# EAGLE design MC-10 Mod A_V (EAGLE 7.2.0)
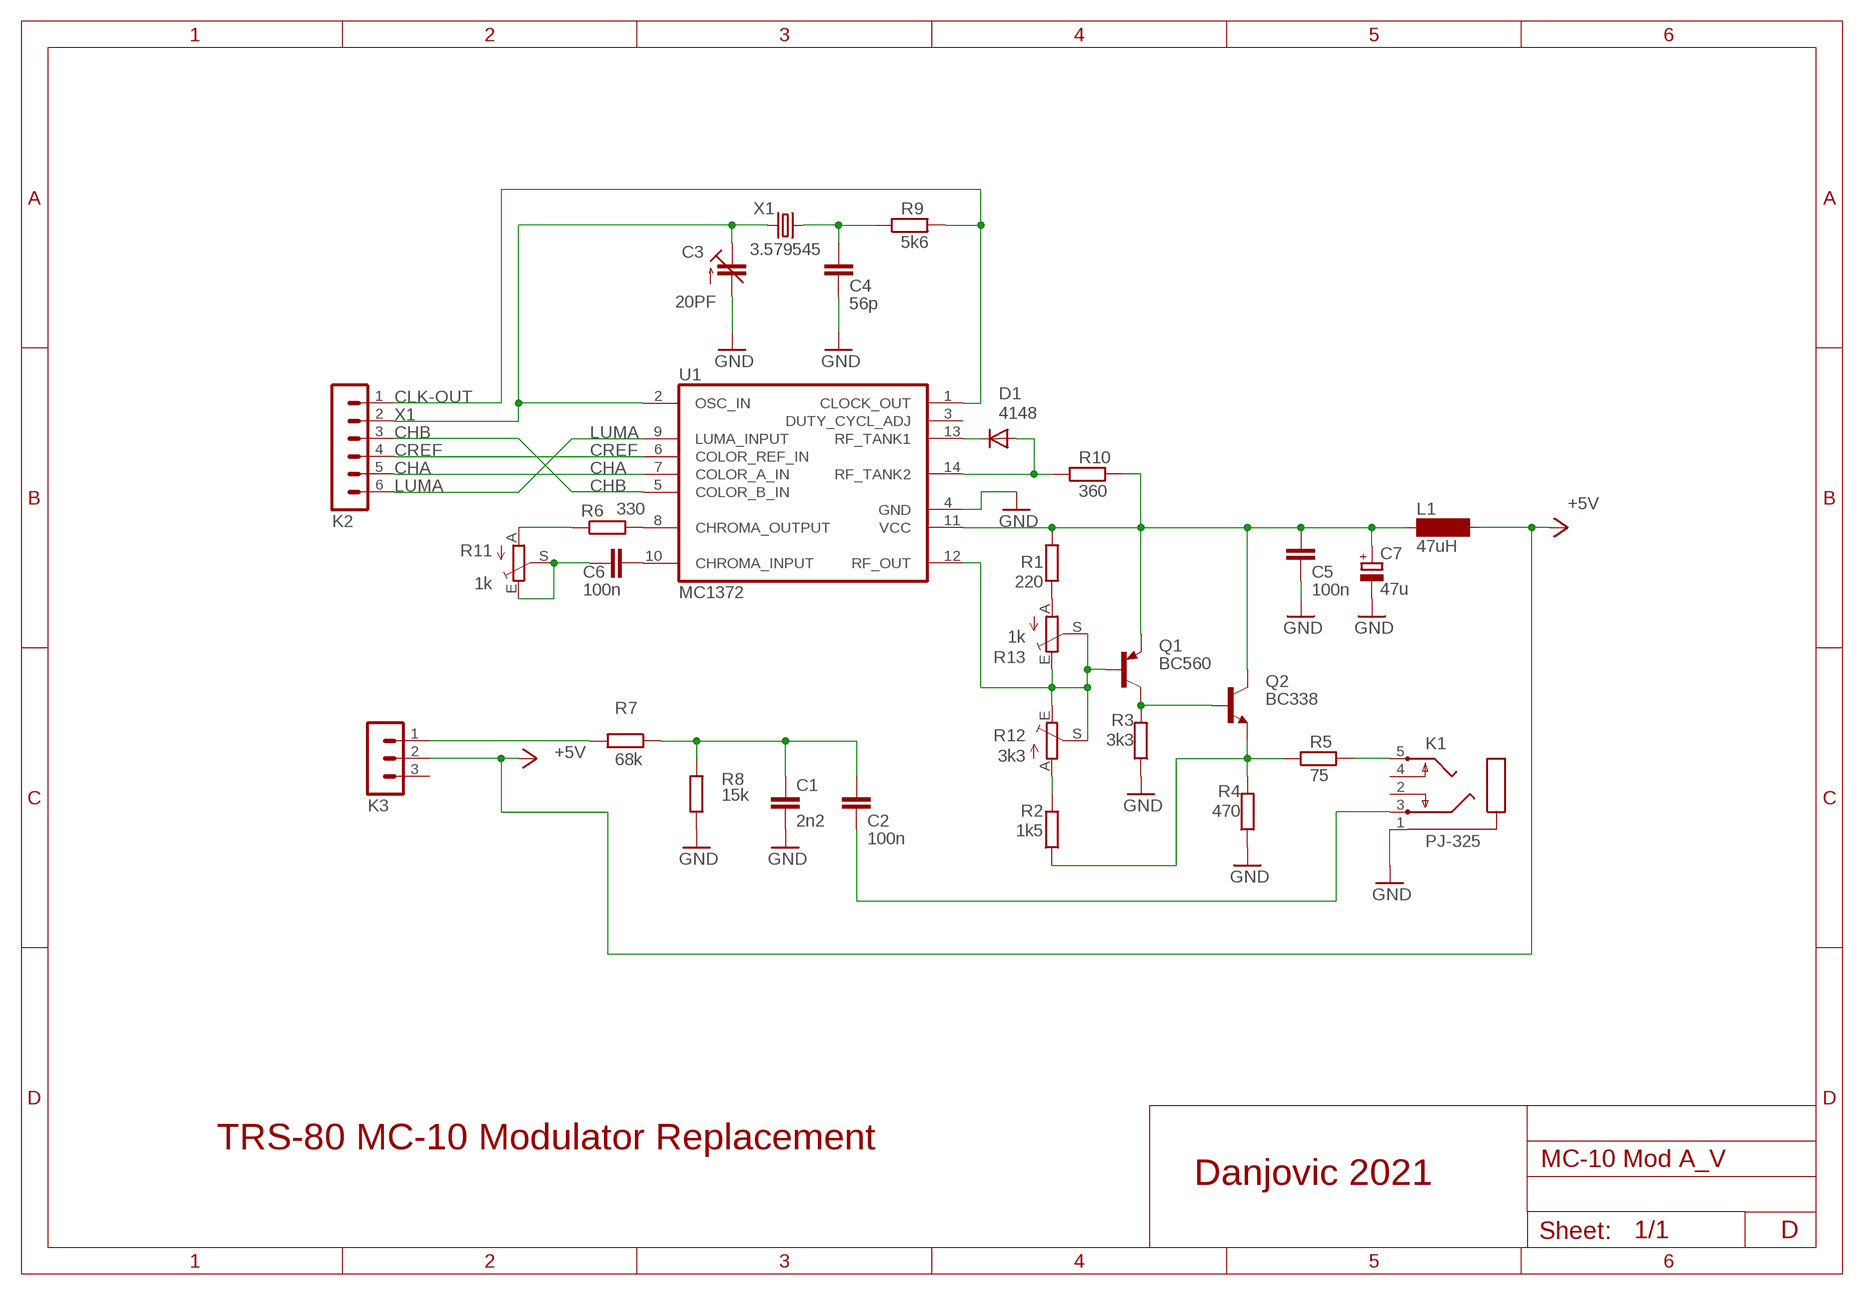
[diagram p0: schematic, sheet 1]

## Parts
C1  2n2  C-EU050-024X044  [C050-024X044]
C2  100n  C-EU050-024X044  [C050-024X044]
C3  20PF  C-TRIMM3050.504  [CTRIM3050.504]
C4  56p  C-EU025-024X044  [C025-024X044]
C5  100n  C-EU050-024X044  [C050-024X044]
C6  100n  C-EU050-024X044  [C050-024X044]
C7  47u  CPOL-EUE2.5-5  [E2,5-5]
D1  4148  DIODE-D-5  [D-5]
K1  PJ-325  [PJ325]
K2  MA06-1  [MA06-1]
K3  MA03-1  [MA03-1]
L1  47uH  BS75  [BS75]
Q1  BC560  BC327  [TO92-EBC]
Q2  BC338  [TO92-EBC]
R1  220  R-EU_0204/7  [0204/7]
R2  1k5  R-EU_0204/7  [0204/7]
R3  3k3  R-EU_0204/7  [0204/7]
R4  470  R-EU_0204/7  [0204/7]
R5  75  R-EU_0204/7  [0204/7]
R6  330  R-EU_0204/7  [0204/7]
R7  68k  R-EU_0204/7  [0204/7]
R8  15k  R-EU_0204/7  [0204/7]
R9  5k6  R-EU_0204/7  [0204/7]
R10  360  R-EU_0204/7  [0204/7]
R11  1k  TRIM_EU-RS3  [RS3]
R12  3k3  TRIM_EU-RS3  [RS3]
R13  1k  TRIM_EU-RS3  [RS3]
U1  MC1372  [DIL14]
X1  3.579545  CRYSTALHC49U70  [HC49U70]

## Nets
+5V: K3.2 L1.2
AUD-OUT: C2.2 K1.3
CHA: K2.5 U1.7(COLOR_A_IN)
CHB: K2.3 U1.5(COLOR_B_IN)
CLK-OUT: K2.1 R9.2 U1.1(CLOCK_OUT)
CREF: K2.4 U1.6(COLOR_REF_IN)
GND: C1.2 C3.2(A) C4.2 C5.2 C7.- K1.1 R3.1 R4.1 R8.1 U1.4(GND)
LUMA: K2.6 U1.9(LUMA_INPUT)
N$1: R6.2 U1.8(CHROMA_OUTPUT)
N$3: C1.1 C2.1 R7.1 R8.2
N$4: D1.C U1.13(RF_TANK1)
N$6: R6.1 R11.A
N$7: Q1.B R12.E R12.S R13.E R13.S U1.12(RF_OUT)
N$8: C6.2 U1.10(CHROMA_INPUT)
N$9: C4.1 R9.1 X1.2
N$10: R1.1 R13.A
N$11: C6.1 R11.E R11.S
N$12: Q1.C Q2.B R3.2
N$13: Q2.E R2.1 R4.2 R5.1
N$14: R2.2 R12.A
N$19: D1.A R10.1 U1.14(RF_TANK2)
SOUND: K3.1 R7.2
VCC: C5.1 C7.+ L1.1 Q1.E Q2.C R1.2 R10.2 U1.11(VCC)
VID-OUT: K1.5 R5.2
X1: C3.1(E) K2.2 U1.2(OSC_IN) X1.1
Unconnected: K1.2 K1.4 K3.3 U1.3(DUTY_CYCL_ADJ)

## Notes on the sheet
- TRS-80 MC-10 Modulator Replacement
- Danjovic 2021
- D

## Library data of the parts
C1 C2 C4-C6 = rcl:C-EU: CAPACITOR, European symbol
C3 = rcl:C-TRIMM: Trimm capacitor
C7 = rcl:CPOL-EU: POLARIZED CAPACITOR, European symbol
D1 = diode:DIODE-: DIODE
K1 = AudioJack:PJ-325: Stereo Jack With Switches
K2 = con-lstb:MA06-1: PIN HEADER; OC_FARNELL: unknown; OC_NEWARK: unknown
K3 = con-lstb:MA03-1: PIN HEADER; OC_FARNELL: unknown; OC_NEWARK: unknown
L1 = inductor-neosid:BS: INDUCTOR nominal inductance, magnetically screened; OC_FARNELL: unknown; OC_NEWARK: unknown
Q1 = transistor-pnp:BC327*: PNP Transistror
Q2 = transistor-npn:BC338*: NPN Transistor
R1-R10 = rcl:R-EU_: RESISTOR, European symbol
R11-R13 = pot:TRIM_EU-: POTENTIOMETER
U1 = MC-10:MC1372: Color TV Video Modulator
X1 = crystal:CRYSTAL: CRYSTAL; OC_FARNELL: unknown; OC_NEWARK: unknown

## Board
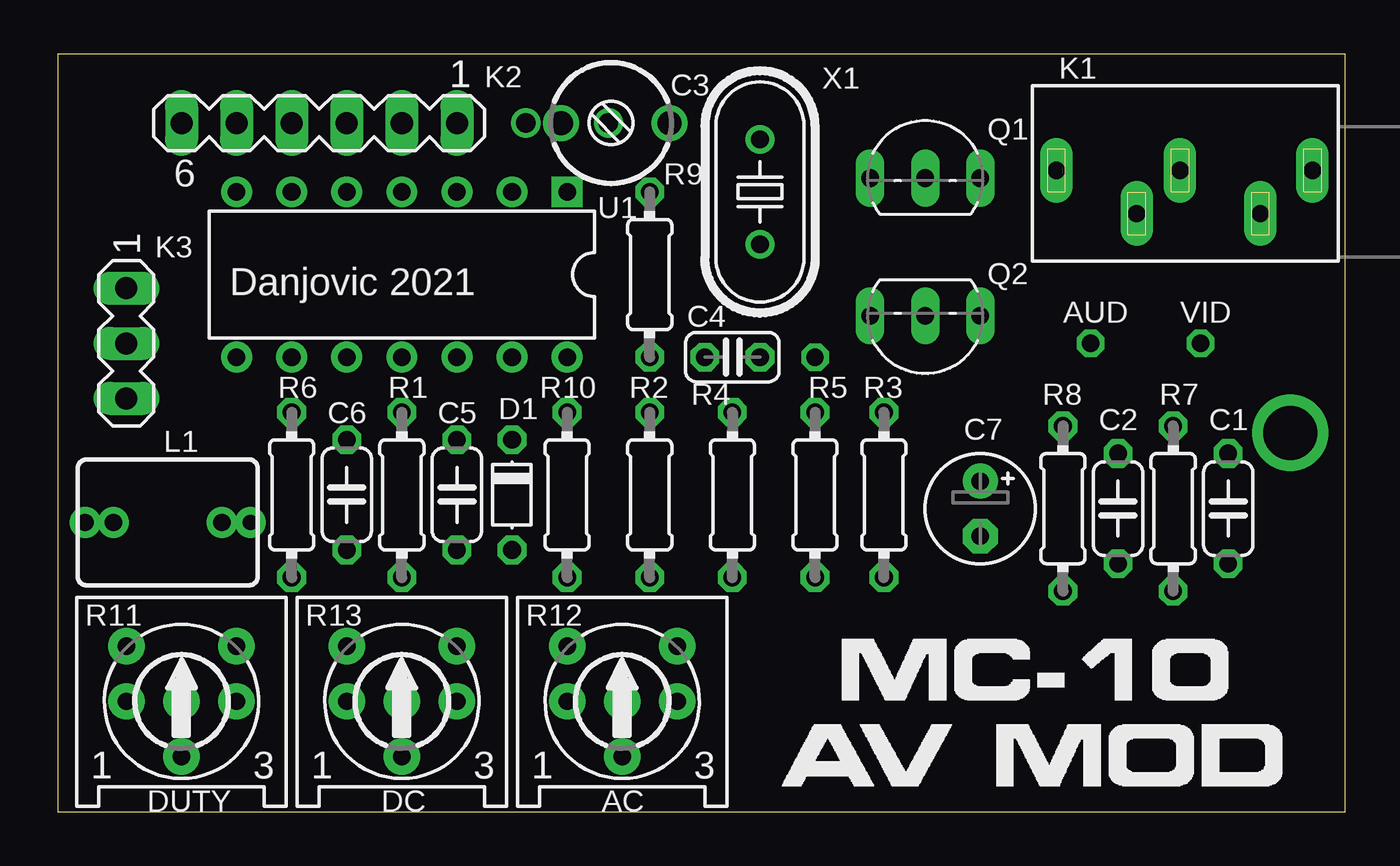
[diagram p1: board, top side]
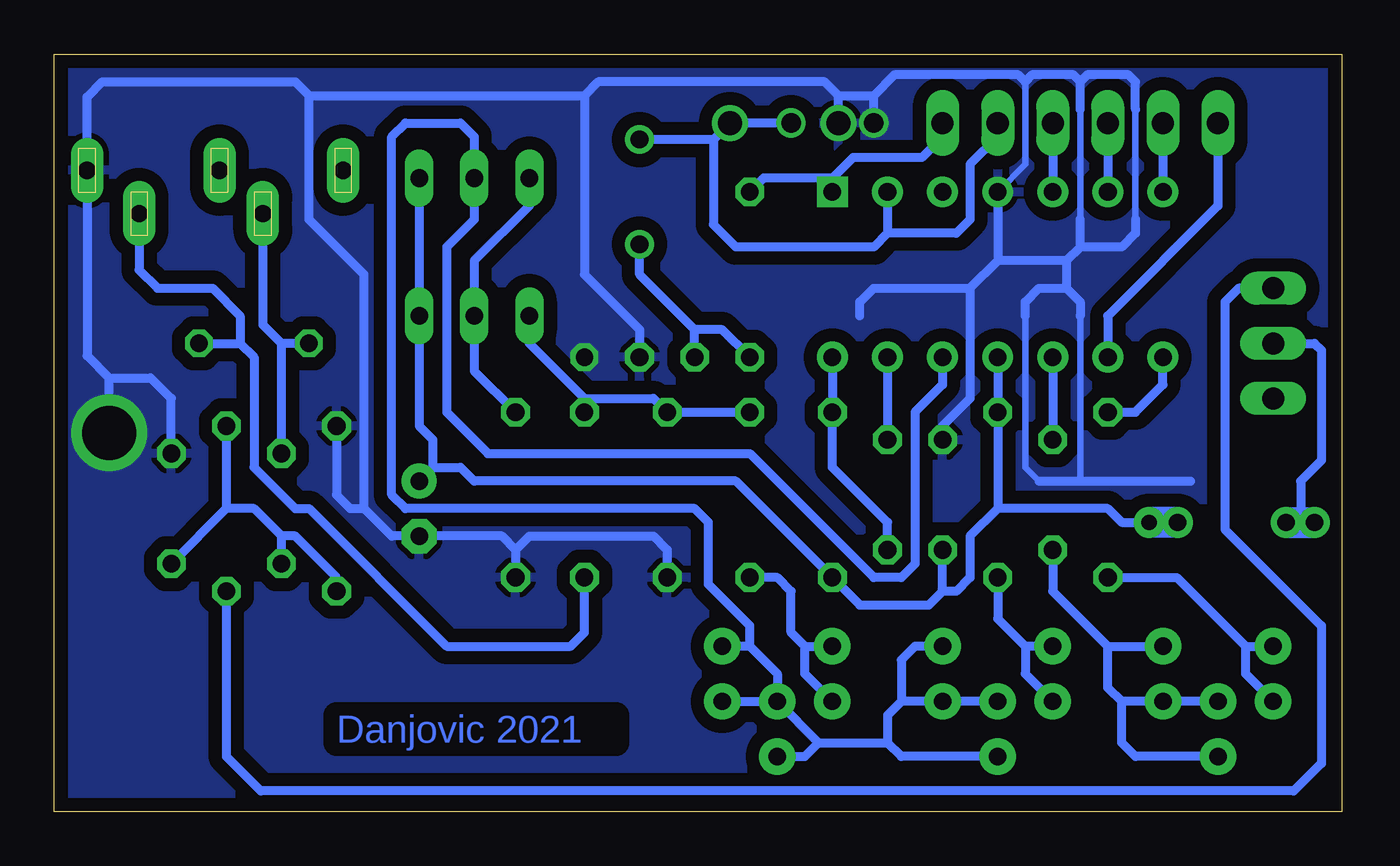
[diagram p2: board, bottom side, seen from below]

Size 59.37 x 34.92 mm. Coordinates in mm from the lower left corner, seen from the top.
Outline: 0,34.92 0,0 59.37,0 59.37,34.92 0,34.92
Copper layers (1*16): Top 0.035mm / dielectric 1.5mm / Bottom 0.035mm
Design rules "default *": minimum track width 10mil, minimum drill 24mil, track to track 8mil, track to pad 8mil, pad to pad 8mil, via to via 8mil, smd to smd 8mil, copper to edge 25mil, drill to drill 8mil, minimum pad ring 10mil, minimum via ring 8mil, stop-mask expansion 4mil, vias tented up to drill 0mil, thermal gap 10mil

### Footprints (pad centres in the part's own frame; a part is rotated, then mirrored left to right if it is on the bottom)
C050-024X044 = drill 0.813 octagon: 1 -2.54,0; 2 2.54,0
CTRIM3050.504 = drill 1.1: 1 -2.5,0; 2 2.5,0
C025-024X044 = drill 0.813 octagon: 1 -1.27,0; 2 1.27,0
E2,5-5 = drill 0.813 pad 1.6: + -1.27,0 | drill 0.813 pad 1.6 octagon: - 1.27,0
D-5 = drill 0.813 octagon: A 2.54,0; C -2.54,0
PJ325 = drill 0.8 pad 1.5 long: 1 1.2,-1; 2 7.3,-1; 3 9.3,1; 4 13,-1; 5 3.6,1
MA06-1 = drill 1.016 long: 1 -6.35,0; 2 -3.81,0; 3 -1.27,0; 4 1.27,0; 5 3.81,0; 6 6.35,0
MA03-1 = drill 1.016 long: 1 -2.54,0; 2 0,0; 3 2.54,0
BS75 = drill 0.8 pad 1.422: 1 -2.5,0; 2 2.5,0
TO92-EBC = drill 0.813 long: B 0,-1.27; C -2.54,-1.27; E 2.54,-1.27
0204/7 = drill 0.813 octagon: 1 -3.81,0; 2 3.81,0
RS3 = drill 0.813 pad 1.676: A -2.54,2.54; E 2.54,2.54; S 0,-2.54
DIL14 = drill 0.813 pad 1.422 square: 1 -7.62,-3.81 | drill 0.813 pad 1.422: 2 -5.08,-3.81; 3 -2.54,-3.81; 4 0,-3.81; 5 2.54,-3.81; 6 5.08,-3.81; 7 7.62,-3.81; 8 7.62,3.81; 9 5.08,3.81; 10 2.54,3.81; 11 0,3.81; 12 -2.54,3.81; 13 -5.08,3.81; 14 -7.62,3.81
HC49U70 = drill 0.813: 1 -2.413,0; 2 2.413,0

### Placement (x,y rotation side)
C1  53.98,13.97 90 top
C2  48.9,13.97 90 top
C3  25.72,31.75 180 top
C4  31.11,20.95 0 top
C5  18.41,14.61 90 top
C6  13.34,14.61 90 top
C7  42.55,13.97 270 top
D1  20.95,14.61 270 top
K1  59.05,28.57 180 top
K2  12.06,31.75 180 top
K3  3.17,21.59 270 top
L1  5.08,13.34 180 top
Q1  40.01,30.48 0 top
Q2  40.01,21.59 180 top
R1  15.88,14.61 90 top
R2  27.3,14.61 270 top
R3  38.1,14.61 90 top
R4  31.11,14.61 90 top
R5  34.93,14.61 270 top
R6  10.79,14.61 90 top
R7  51.44,13.97 270 top
R8  46.36,13.97 270 top
R9  27.3,24.77 90 top
R10  23.49,14.61 270 top
R11  5.71,5.08 0 top
R12  26.04,5.08 0 top
R13  15.88,5.08 0 top
U1  15.88,24.77 180 top
X1  32.39,28.57 270 top

### Tracks (layer width: path | path; a pad name or v marks a point on that pad's centre or on a via)
+5V  (via drill 0.8 pad 1.42)
  Bottom 0.406: K3.2 1.27,21.59 0.95,21.27 0.95,16.19 1.91,15.24 1.91,13.34 | 0.95,13.65 v1.27,13.34
  Bottom 1.422: L1.2 1.91,13.34 v1.27,13.34
AUD-OUT  (via drill 0.8 pad 1.27)
  Bottom 0.406: C2.2 48.9,21.59 | 48.9,21.59 49.76,22.45 K1.3 | v47.62,21.59 48.9,21.59
CHA
  Bottom 0.406: K2.5 U1.7
CHB
  Bottom 0.406: K2.3 U1.5
CLK-OUT
  Bottom 0.406: K2.1 18.41,31.11 19.37,30.16 22.54,30.16 23.49,29.21 | 23.49,29.21 26.67,29.21 R9.2 | U1.1 23.49,29.21
CREF
  Bottom 0.406: K2.4 U1.6
GND  (via drill 0.8 pad 1.27, 0.9, 2.5)
  Bottom 0.305: 14.61,33.66 14.61,29.84 U1.4 | 14.61,22.86 14.61,15.88 13.97,15.24 | 12.06,22.86 12.06,15.24 | 12.06,32.38 12.06,27.3 | 9.53,32.38 9.53,27.3
  Bottom 0.406: U1.4 15.88,25.4 | 15.88,25.4 17.14,24.13 | 17.14,24.13 17.14,19.05 18.41,17.78 C5.2 | 12.06,33.66 11.75,33.97 9.84,33.97 9.53,33.66 9.53,32.38 | 12.06,32.38 12.06,33.66 | 12.06,33.66 12.38,33.97 14.29,33.97 14.61,33.66 14.92,33.97 20.64,33.97 21.59,33.02 | 34.93,33.02 34.29,33.66 23.85,33.66 23.22,33.02 | 34.93,33.02 34.93,24.77 32.39,22.23 C4.2 | 47.62,33.02 48.26,33.66 57.15,33.66 57.86,32.95 K1.1 57.86,21.02 56.83,20 | 47.62,33.02 34.93,33.02 | R4.1 31.11,12.06 31.75,12.7 37.47,12.7 38.1,12.06 | 45.09,13.97 45.09,24.77 47.62,27.3 47.62,33.02 | 9.53,27.3 9.53,26.67 10.16,26.04 12.06,26.04 | 12.06,26.04 12.06,27.3 | 12.06,26.04 12.7,25.4 | 12.7,25.4 12.7,24.13 | 12.7,24.13 12.06,23.5 12.06,22.86 | 12.7,25.4 15.88,25.4 | 14.61,22.86 14.61,23.5 13.97,24.13 12.7,24.13 | 22.22,22.86 22.22,23.5 21.59,24.13 17.14,24.13 | 13.97,15.24 12.06,15.24 6.99,15.24 | 38.1,12.06 R3.1 | 38.1,12.06 38.73,12.7 43.82,12.7 45.09,13.97 | R8.1 46.36,14.61 45.72,13.97 45.09,13.97 | v56.83,17.46 56.83,20 | C1.2 53.98,19.05 54.93,20 56.83,20 | v21.59,31.75 21.59,33.02 | C3.2 23.22,33.02 | 23.22,33.02 21.59,33.02
  other vias: 34.93,20.95
  pour Bottom (isolate 0.61): -0.64,34.92 -0.64,0 59.37,0 59.37,34.92
LUMA
  Bottom 0.406: K2.6 5.71,27.94 10.79,22.86 U1.9
N$1
  Bottom 0.406: R6.2 9.53,18.41 8.26,19.68 U1.8
N$3
  Bottom 0.406: R8.2 46.36,10.79 48.26,12.7 48.9,12.7 | 48.9,12.7 50.16,13.97 51.44,13.97 | 51.44,13.97 C1.1 | R7.1 51.44,13.97 | C2.1 48.9,12.7
N$4
  Bottom 0.406: U1.13 D1.C
N$6  (via drill 0.8 pad 1.68)
  Bottom 0.406: R6.1 7.62,10.79 4.45,7.62 | v3.17,5.08 4.45,6.35 4.45,7.62 | 4.45,7.62 R11.A
N$7  (via drill 0.8 pad 1.68)
  Bottom 0.406: U1.12 18.41,19.68 19.68,18.41 19.68,11.43 20.32,10.79 21.59,10.79 27.3,16.51 39.37,16.51 41.27,18.41 41.27,26.04 40.01,27.3 Q1.B 40.01,31.11 40.64,31.75 43.18,31.75 43.82,31.11 43.82,14.61 43.18,13.97 29.84,13.97 29.21,13.34 29.21,10.48 27.3,8.57 27.3,7.62 | 27.3,7.62 R12.E | 24.13,3.17 20.95,3.17 | 20.95,3.17 20.32,2.54 R13.S | 20.32,5.08 v18.41,5.08 v15.88,5.08 | 20.32,5.08 20.95,4.45 20.95,3.17 | R13.E 19.68,7.62 20.32,6.99 20.32,5.08 | v28.57,5.08 v26.04,5.08 | 27.3,7.62 26.04,6.35 v26.04,5.08 | v26.04,5.08 24.13,3.17 | R12.S 24.76,2.54 24.13,3.17
N$8
  Bottom 0.406: U1.10 C6.2
N$9
  Bottom 0.406: R9.1 28.57,22.23 29.84,22.23 | 29.84,22.23 32.39,24.77 X1.2 | C4.1 29.84,22.23
N$10  (via drill 0.8 pad 1.68)
  Bottom 0.406: R1.1 15.88,8.89 14.61,7.62 | 14.61,7.62 14.61,6.35 v13.34,5.08 | R13.A 14.61,7.62
N$11  (via drill 0.8 pad 1.68)
  Bottom 0.406: C6.1 13.34,10.16 10.79,7.62 | 10.79,7.62 R11.E | 10.16,5.08 v8.26,5.08 v5.71,5.08 | 10.16,5.08 10.79,5.71 10.79,7.62 | R11.S 9.53,2.54 10.16,3.17 10.16,5.08
N$12
  Bottom 0.406: Q1.C 37.47,27.94 40.01,25.4 Q2.B 40.01,20.32 R3.2
N$13
  Bottom 0.406: 34.93,19.05 31.75,19.05 R4.2 R2.1 | 34.93,19.05 R5.1 | Q2.E 37.47,21.59 34.93,19.05
N$14  (via drill 0.8 pad 1.68)
  Bottom 0.406: v23.49,5.08 24.76,6.35 24.76,7.62 | 24.76,7.62 R12.A | 24.76,7.62 25.4,8.26 25.4,10.16 26.04,10.79 R2.2
N$19
  Bottom 0.406: U1.14 R10.1 23.49,15.88 20.95,13.34 D1.A
SOUND
  Bottom 0.406: R7.2 51.44,2.54 49.85,0.95 2.22,0.95 0.95,2.22 0.95,8.57 5.4,13.02 5.4,23.5 4.76,24.13 K3.1 2.22,24.13
VCC  (via drill 0.7 pad 1.42)
  Bottom 0.406: U1.11 R1.2 15.88,13.97 | Q1.E Q2.C 42.55,17.78 41.91,17.14 41.91,15.88 | 18.41,10.16 19.05,9.53 22.22,9.53 R10.2 27.94,15.24 40.01,15.24 40.64,15.88 41.91,15.88 | 18.41,10.16 C5.1 | 15.88,13.97 17.14,12.7 17.14,10.79 17.78,10.16 18.41,10.16 | 15.88,13.97 10.79,13.97 10.16,13.34 v8.89,13.34 | C7.+ 41.91,15.88
  Bottom 1.422: L1.1 v8.89,13.34
VID-OUT  (via drill 0.8 pad 1.27)
  Bottom 0.406: K1.5 55.46,24.98 54.61,24.13 52.07,24.13 50.8,22.86 50.8,21.59 | R5.2 34.93,8.26 35.56,7.62 41.27,7.62 47.62,13.97 48.26,13.97 50.16,15.88 50.16,20.95 50.8,21.59 | v52.71,21.59 50.8,21.59
X1  (via drill 0.9)
  Bottom 0.406: 15.88,32.07 K2.2 15.88,31.11 17.14,29.84 17.14,27.3 17.78,26.67 20.95,26.67 | 20.95,26.67 21.59,26.04 27.94,26.04 28.98,27.07 28.98,30.99 | U1.2 20.95,26.67 | v25.4,31.75 C3.1 28.98,30.99 | 28.98,30.99 X1.1

### Text on the board
Bottom: Danjovic 2021
tPlace: Danjovic 2021 | AUD | VID | DUTY | DC | AC